# EAGLE design roco1044 (EAGLE 9.5.2)
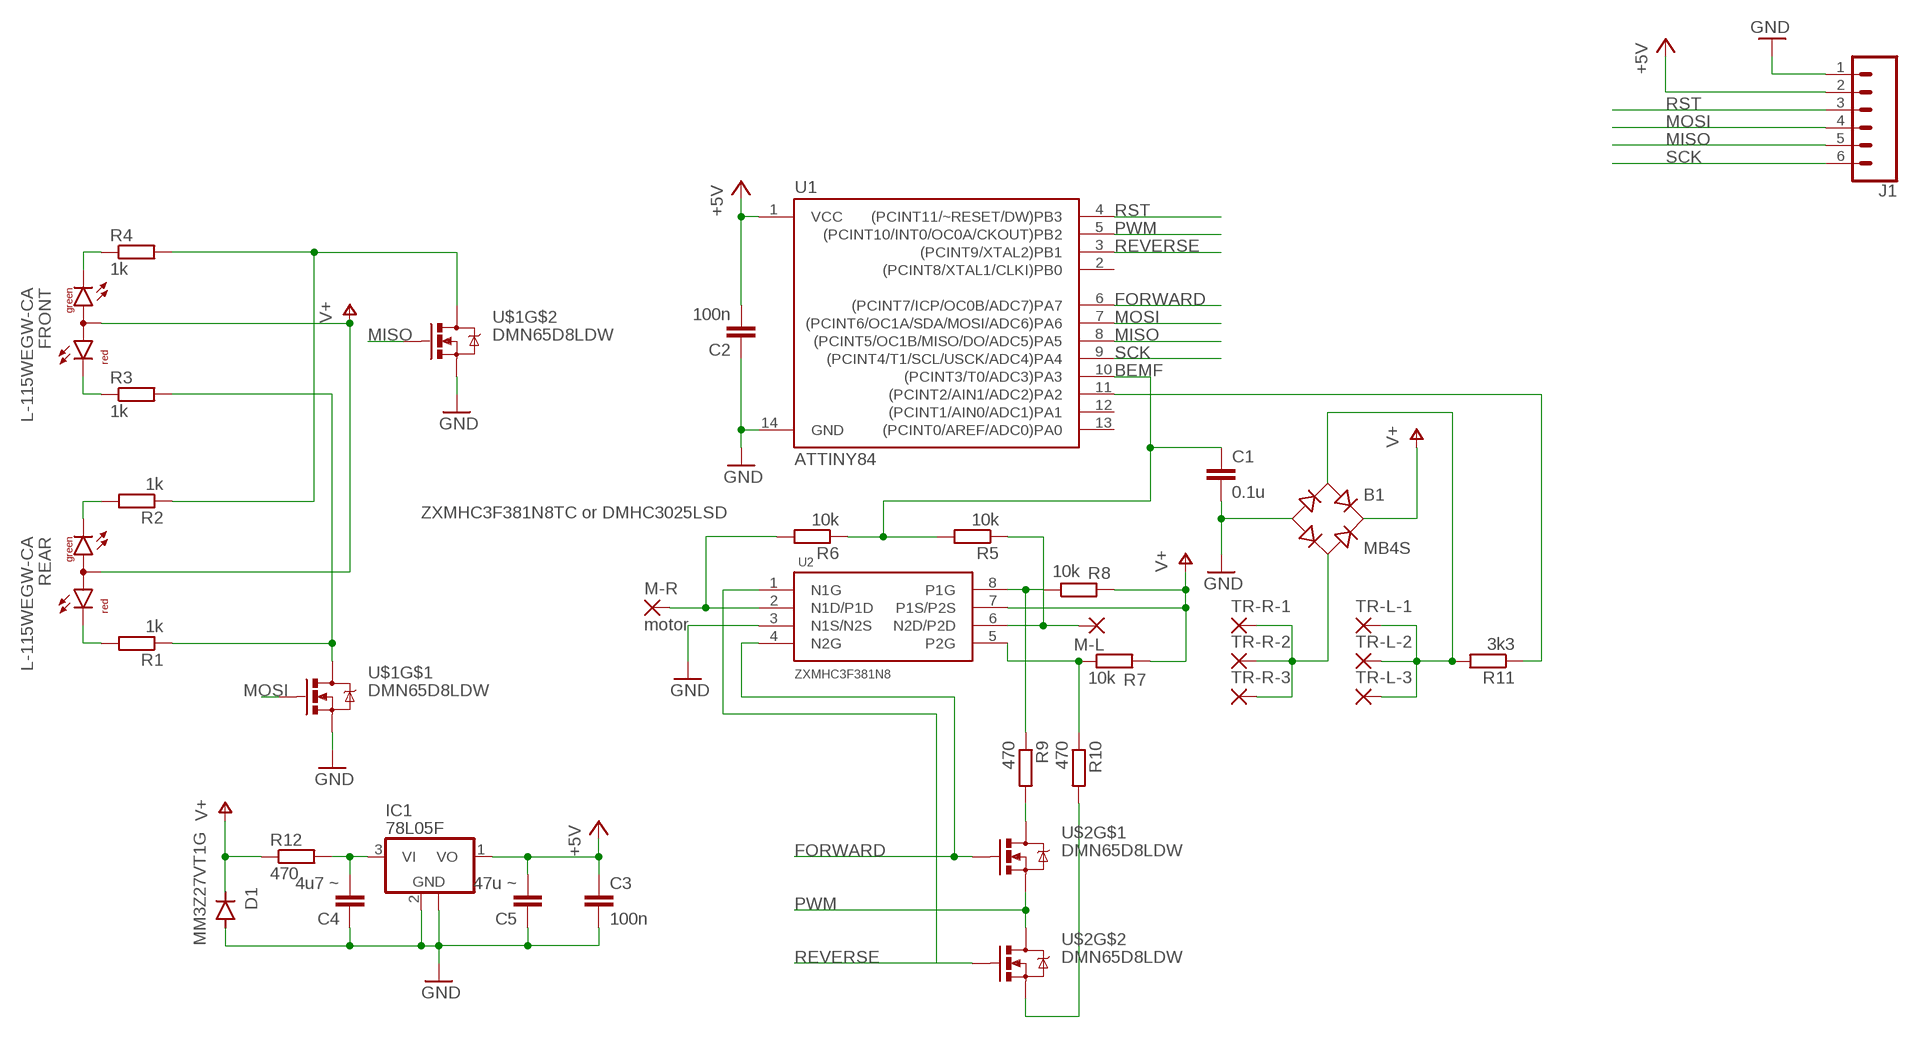
[diagram p0: schematic, sheet 1]

## Parts
B1  MB4S  [SOIC-4]
C1  0.1u  C-EUC0805  [C0805]
C2  100n  C-EUC1210  [C1210]
C3  100n  C-EUC1210  [C1210]
C4  4u7 ~  C-EUC3216  [C3216]
C5  47u ~  C-EUC3216  [C3216]
D1  MM3Z27VT1G  DIODE-SOD323-R  [SOD323-R]
FRONT  L-115WEGW-CA  [DUOLED-A-3MM]
IC1  78L05F  [SOT89]
J1  CONN_061.27MM  [1X06_1.27MM]
M-L  SMD5  [SMD2,54-5,08]
M-R  motor  SMD5  [SMD2,54-5,08]
R1  1k  R-EU_R0805  [R0805]
R2  1k  R-EU_R0805  [R0805]
R3  1k  R-EU_R0805  [R0805]
R4  1k  R-EU_R0805  [R0805]
R5  10k  R-EU_R0805  [R0805]
R6  10k  R-EU_R0805  [R0805]
R7  10k  R-EU_R0805  [R0805]
R8  10k  R-EU_R0805  [R0805]
R9  470  R-EU_R0805  [R0805]
R10  470  R-EU_R0805  [R0805]
R11  3k3  R-EU_R0805  [R0805]
R12  470  R-EU_R0805  [R0805]
REAR  L-115WEGW-CA  [DUOLED-A-3MM]
TR-L-1  SMD5  [SMD2,54-5,08]
TR-L-2  SMD5  [SMD2,54-5,08]
TR-L-3  SMD5  [SMD2,54-5,08]
TR-R-1  SMD5  [SMD2,54-5,08]
TR-R-2  SMD5  [SMD2,54-5,08]
TR-R-3  SMD5  [SMD2,54-5,08]
U1  ATTINY84  [SO14]
U2  ZXMHC3F381N8  [SOIC8]
U$1  DMN65D8LDW  [SOT363]
U$2  DMN65D8LDW  [SOT363]

## Nets
+5V: C2.2 C3.1 C5.2 IC1.1(VO) J1.2 U1.1(VCC)
BEMF: C1.1 R5.2 R6.1 U1.10((PCINT3/T0/ADC3)PA3)
FORWARD: U1.6((PCINT7/ICP/OC0B/ADC7)PA7) U2.4(N2G) U$2.P$2(G)
GND: B1.- C1.2 C2.1 C3.2 C4.1 C5.1 D1.A IC1.2(GND) IC1.2@1(GND) J1.1 U1.14(GND) U2.3(N1S/N2S) U$1.P$3(S) U$1.P$6(S)
MISO: J1.5 U1.8((PCINT5/OC1B/MISO/DO/ADC5)PA5) U$1.P$5(G)
MOSI: J1.4 U1.7((PCINT6/OC1A/SDA/MOSI/ADC6)PA6) U$1.P$2(G)
N$2: B1.~1(AC1) R11.2 TR-L-1.1(P) TR-L-2.1(P) TR-L-3.1(P)
N$3: B1.~2(AC2) TR-R-1.1(P) TR-R-2.1(P) TR-R-3.1(P)
N$4: M-R.1(P) R6.2 U2.2(N1D/P1D)
N$5: R2.1 R4.2 U$1.P$1(D)
N$6: R1.2 REAR.3(CR)
N$7: R2.2 REAR.1(CG)
N$8: R1.1 R3.2 U$1.P$4(D)
N$9: FRONT.3(CR) R3.1
N$10: FRONT.1(CG) R4.1
N$11: M-L.1(P) R5.1 U2.6(N2D/P2D)
N$12: R11.1 U1.11((PCINT2/AIN1/ADC2)PA2)
N$14: R7.1 R10.1 U2.5(P2G)
N$15: R8.1 R9.1 U2.8(P1G)
N$17: C4.2 IC1.3(VI) R12.2
N$20: R9.2 U$2.P$4(D)
N$22: R10.2 U$2.P$6(S)
PWM: U1.5((PCINT10/INT0/OC0A/CKOUT)PB2) U$2.P$1(D) U$2.P$3(S)
REVERSE: U1.3((PCINT9/XTAL2)PB1) U2.1(N1G) U$2.P$5(G)
RST: J1.3 U1.4((PCINT11/~RESET/DW)PB3)
SCK: J1.6 U1.9((PCINT4/T1/SCL/USCK/ADC4)PA4)
V+: B1.+ D1.C FRONT.2(A) R7.2 R8.2 R12.1 REAR.2(A) U2.7(P1S/P2S)
Unconnected: U1.2((PCINT8/XTAL1/CLKI)PB0) U1.12((PCINT1/AIN0/ADC1)PA1) U1.13((PCINT0/AREF/ADC0)PA0)

## Notes on the sheet
- ZXMHC3F381N8TC or DMHC3025LSD

## Library data of the parts
B1 = rectifier:MB*S: Bridge Rectifier Source: http://www.fairchildsemi.com/ds/MB/MB6S.pdf
C1 = resistor:C-EU: CAPACITOR, European symbol
C2-C5 = rcl:C-EU: CAPACITOR, European symbol; SPICEPREFIX: C
D1 = diode:DIODE-: DIODE
FRONT REAR = led:L-115WEGW-CA: T-1(3mm) BI-COLOR INDICATOR LAMP Source: Kingbright .. 2_colour_led_.pdf
IC1 = linear:78L*: POSITOIV-VOLTAGE REGULATORS Output up to 100 mA Source: Datasheet <http://focus.ti.com/lit/ds/symlink/ua78l05.pdf>
J1 = SparkFun-Connectors:CONN_06: Multi connection point. Often used as Generic Header-pin footprint for 0.1 inch spaced/style header connections On any of the 0.1 inch spaced packages, you can populate with these: Break Away Headers - Straight <https://www.sparkfun.com/products/116> (PRT-00116) Break Away Male Headers - Right Angle <https://www.sparkfun.com/products/553> (PRT-00553) Female Headers <https://www.sparkfun.com/products/115> (PRT-00115) Break Away Headers - Machine Pin <https://www.sparkfun.com/products/117> (PRT-00117) Break Away Female Headers - Swiss Machine Pin <https://www.sparkfun.com/products/743> (PRT-00743) Arduino Stackable Header - 6 Pin <https://www.sparkfun.com/products/9280> (PRT-09280) For SCREWTERMINALS and SPRING TERMINALS visit here: Screw Terimnals on SparkFun.com <https://www.sparkfun.com/search/results?term=Screw+Terminals> (5mm/3.5mm/2.54mm spacing) This device is also useful as a general connection point to wire up your design to another part of your project. Our various solder wires solder well into these plated through hole pads. Hook-Up Wire - Assortment (Stranded, 22 AWG) <https://www.sparkfun.com/products/11375> (PRT-11375) Hook-Up Wire - Assortment (Solid Core, 22 AWG) <https://www.sparkfun.com/products/11367> (PRT-11367) View the entire wire category on our website here <https://www.sparkfun.com/categories/141>
M-L M-R TR-L-1-TR-L-3 TR-R-1-TR-R-3 = wirepad:SMD5: SMD PAD
R1-R12 = rcl:R-EU_: RESISTOR, European symbol; SPICEPREFIX: R
U1 = SparkFun-IC-Microcontroller:ATTINY84: Atmel 14-pin 2/4/8kB flash uC Datasheet <https://cdn.sparkfun.com/datasheets/Widgets/doc8006.pdf> SparkFun Products Tiny AVR Programmer <https://www.sparkfun.com/products/11801> (PGM-11801) SparkFun Servo Trigger - Continuous Rotation <https://www.sparkfun.com/products/13872> (WIG-13872) SparkFun Servo Trigger <https://www.sparkfun.com/products/13118> (WIG-13118); PROD_ID: IC-11285
U2 = bt_motordriver:ZXMHC3F381N8: 30V SO8 Complementary enhancement mode MOSFET H-Bridge This new generation complementary MOSFET H-Bridge features low on-resistance achievable with low gate drive (Vgs=4.5V). Reference: <http://www.diodes.com/datasheets/ZXMHC3F381N8.pdf>http://www.diodes.com/datasheets/ZXMHC3F381N8.pdf
U$1 U$2 = Railstars:DMN65D8LDW

## Board
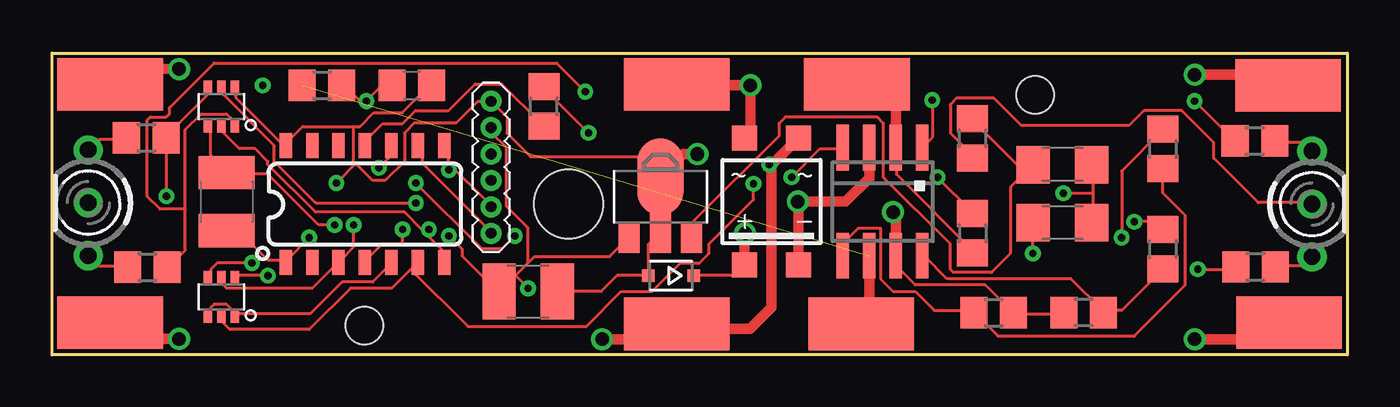
[diagram p1: board, top side]
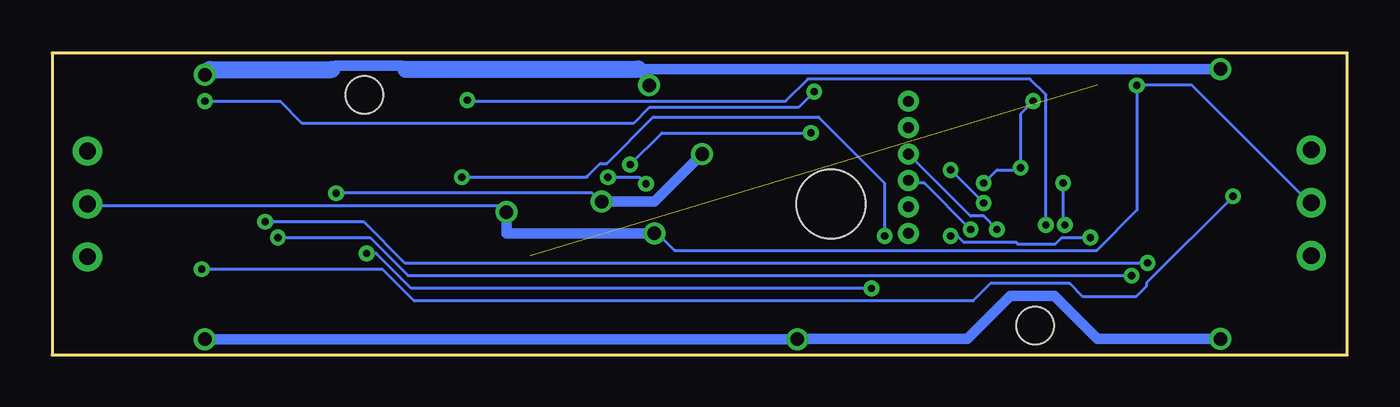
[diagram p2: board, bottom side, seen from below]

Size 62.2 x 14.5 mm. Coordinates in mm from the lower left corner, seen from the top.
Outline: 0,0 0,14.5 62.2,14.5 62.2,0 0,0
Copper layers (1*16): Top 0.035mm / dielectric 1.5mm / Bottom 0.035mm
Design rules "default *": minimum track width 6mil, minimum drill 0.35mm, track to track 6mil, track to pad 6mil, pad to pad 6mil, via to via 6mil, smd to smd 6mil, copper to edge 6mil, drill to drill 6mil, minimum pad ring 10mil, minimum via ring 8mil, stop-mask expansion 4mil, vias tented up to drill 0mil, thermal gap 10mil
Holes 1.8 mm at 15,1.4 47.2,12.5
Holes 3.3 mm at 24.8,7.25

### Footprints (pad centres in the part's own frame; a part is rotated, then mirrored left to right if it is on the bottom)
SOIC-4 = smd 1.2 x 1.2: + 1.3,3.05; - -1.3,3.05; ~1 -1.3,-3.05; ~2 1.3,-3.05
C0805 = smd 1.3 x 1.5: 1 -0.95,0; 2 0.95,0
C1210 = smd 1.6 x 2.7: 1 -1.4,0; 2 1.4,0
C3216 = smd 1.6 x 1.8: 1 -1.4,0; 2 1.4,0
SOD323-R = smd 0.6 x 0.6: A 1.1,0; C -1.1,0
DUOLED-A-3MM = drill 0.8 pad 1.4: 1 -2.54,0; 2 0,0; 3 2.54,0
SOT89 = smd 1 x 1.5: 1 -1.499,-1.981; 3 1.499,-1.981 | smd 1 x 2: 2 0,-1.727 | smd 2.2 x 3.7: 2@1 0,0.94
1X06_1.27MM = drill 0.508 pad 1: 1 0,0; 2 1.27,0; 3 2.54,0; 4 3.81,0; 5 5.08,0; 6 6.35,0
SMD2,54-5,08 = smd 2.54 x 5.08: 1 0,0
R0805 = smd 1.3 x 1.5: 1 -0.95,0; 2 0.95,0
SO14 = smd 0.6 x 1.2: 1 -3.175,-2.8; 2 -1.905,-2.8; 3 -0.635,-2.8; 4 0.635,-2.8; 5 1.905,-2.8; 6 3.175,-2.8; 7 4.445,-2.8; 8 4.445,2.8; 9 3.175,2.8; 10 1.905,2.8; 11 0.635,2.8; 12 -0.635,2.8; 13 -1.905,2.8; 14 -3.175,2.8
SOIC8 = smd 0.6 x 2.2: 1 -1.905,-2.6; 2 -0.635,-2.6; 3 0.635,-2.6; 4 1.905,-2.6; 5 1.905,2.6; 6 0.635,2.6; 7 -0.635,2.6; 8 -1.905,2.6
SOT363 = smd 0.42 x 0.6: P$1 -0.65,0.95; P$2 0,0.95; P$3 0.65,0.95; P$4 0.65,-0.95; P$5 0,-0.95; P$6 -0.65,-0.95

### Placement (x,y rotation side)
B1  34.54,7.37 180 top
C1  17.27,12.95 0 top
C2  8.38,7.37 270 top
C3  22.86,3.05 0 top
C4  48.51,9.14 180 top
C5  48.51,6.35 180 top
D1  29.72,3.81 180 top
FRONT  1.74,7.31 90 top
IC1  29.21,7.62 0 top
J1  21.08,12.19 270 top
M-L  38.85,1.5 90 top
M-R  38.65,13 90 top
R1  57.8,4.23 0 top
R2  57.75,10.28 0 top
R3  4.52,10.43 0 top
R4  4.58,4.22 0 top
R5  12.95,12.95 0 top
R6  44.2,5.84 270 top
R7  45.21,2.03 0 top
R8  49.53,2.03 180 top
R9  53.34,5.08 90 top
R10  53.34,9.91 90 top
R11  23.62,11.94 90 top
R12  44.2,10.41 90 top
REAR  60.5,7.25 270 top
TR-L-1  2.8,1.55 90 top
TR-L-2  59.4,1.55 90 top
TR-L-3  30,1.5 270 top
TR-R-1  2.8,13 90 top
TR-R-2  59.35,12.95 270 top
TR-R-3  30,13 90 top
U1  14.39,7.25 0 top
U2  39.88,7.37 180 top
U$1  8.13,11.94 180 top
U$2  8.13,2.79 180 top

### Tracks (layer width: path | path; a pad name or v marks a point on that pad's centre or on a via)
+5V  (via drill 0.35)
  Top 0.152: C2.2 8.38,5.94 8.99,5.94 10.36,4.57 11.12,4.57 U1.1 11.28,4.57 v12.34,5.64 | 22.25,3.81 21.49,3.05 C3.1 | 22.25,3.81 22.87,4.43 | 22.87,4.43 23.16,4.72 26.77,4.72 27.58,5.54 27.58,5.64 IC1.1 | v47.09,4.88 47.09,6.25 C5.2 | 22.25,3.81 v22.86,3.2 | 22.25,3.81 C3.1 | 22.87,4.43 22.86,4.45 22.86,6.1 21.82,7.14 21.82,9.96 21.08,10.69 J1.2 | v19.05,5.71 19.68,5.08 19.68,4.76 21.27,3.17 C3.1
  Bottom 0.152: v47.09,4.88 46.63,4.88 44.96,3.2 v22.86,3.2 | v12.34,5.64 13.72,5.64 14.02,5.33 15.85,5.33 15.88,5.4 18.41,5.4 18.73,5.71 v19.05,5.71
BEMF  (via drill 0.35)
  Top 0.152: v15.7,8.99 16.15,9.45 16.15,9.91 U1.10 | R5.2 14.02,12.95 14.78,12.19 v15.09,12.19 15.85,12.95 C1.1 | v42.52,8.53 44.2,6.86 R6.1 | v17.46,8.26 20.64,5.08 21.59,5.08 v22.23,5.71
  Bottom 0.152: v15.09,12.19 15.7,11.58 v15.7,8.99 15.88,8.89 16.83,8.89 v17.46,8.26 | v42.52,8.53 36.51,8.53 36.51,8.57 35.88,9.21 35.56,9.21 33.34,11.43 25.4,11.43 22.23,8.26 v22.23,5.71
FORWARD  (via drill 0.35)
  Top 0.152: 17.22,4.12 17.53,4.42 U1.6 | 17.22,4.12 16.31,3.2 14.33,3.2 12.34,1.22 8.53,1.22 8.23,1.52 8.23,1.83 U$2.P$2 | v35.51,8.53 36.88,9.91 37.95,9.91 U2.4 | v33.68,8.23 33.68,7.47 31.55,5.33 31.55,4.88 31.09,4.42 30.18,4.42 28.8,3.05 27.33,3.05 25.65,1.37 19.96,1.37 17.22,4.12
  Bottom 0.152: v35.51,8.53 33.98,8.53 v33.68,8.23
GND  (via drill 0.35, 0.65)
  Top 0.152: 11.12,10.06 8.84,12.34 8.84,12.8 U$1.P$6 | 14.48,10.97 12.04,10.97 11.12,10.06 | 14.48,10.97 14.78,10.97 15.44,11.63 16.82,11.63 18.14,12.95 C1.2 | 11.12,10.06 U1.14 | U$1.P$3 7.62,10.97 7.62,9.6 8.38,8.84 C2.1 8.38,8.69 10.36,8.69 12.8,6.25 v13.56,6.25 | 49.99,7.77 49.99,9.14 C4.1 | 49.99,7.77 49.99,6.4 C5.1 | 29.26,5.94 29.26,8.38 IC1.2@1 28.89,8.89 28.89,9.21 28.57,9.53 22.97,9.53 21.84,10.65 21.84,11.43 J1.1 20.45,12.19 19.42,11.16 17.41,11.16 16.92,10.67 16.92,9.3 16,8.38 15.39,8.38 14.59,9.19 | 29.26,5.94 IC1.2 | C3.2 26.36,3.05 27.13,3.81 D1.A 28.65,3.81 28.65,5.33 29.26,5.94 | v48.56,7.77 49.99,7.77 | 14.48,10.97 14.48,9.3 14.59,9.19 | 14.59,9.19 v13.65,8.26
  Top 0.508: B1.- 35.84,7.37 v35.81,7.37 38.1,7.37 39.24,8.51 U2.3 | v30.99,9.65 30.3,9.65 IC1.2@1
  Bottom 0.152: v48.56,7.77 36.27,7.77 35.97,7.47 v35.81,7.37 | v13.65,8.26 13.65,6.35 v13.56,6.25
  Bottom 0.508: v35.81,7.37 33.27,7.37 v30.99,9.65
MISO  (via drill 0.35)
  Top 0.152: U$1.P$5 8.23,12.8 8.23,12.5 10.67,10.06 10.67,9.3 12.68,7.28 12.7,7.3 v17.46,7.3 | 19.05,9.21 19.05,9.84 U1.8 | 19.05,9.21 20.95,7.3 J1.5 | v19.05,8.89 19.05,9.21
  Bottom 0.152: v17.46,7.3 v19.05,8.89
MOSI  (via drill 0.35)
  Top 0.152: 18.75,5.03 17.76,6.01 | 17.76,6.01 16.92,6.86 12.65,6.86 10.36,9.14 10.36,9.3 9.75,9.91 8.99,9.91 8.23,10.67 8.23,10.97 U$1.P$2 | 18.75,5.03 18.75,4.57 U1.7 18.75,5.03 | v18.1,6.03 17.78,6.03 17.76,6.01
  Bottom 0.152: v18.1,6.03 20.32,8.26 20.95,8.26 J1.4
N$2  (via drill 0.35, 0.65)
  Top 0.152: v25.76,10.67 23.62,12.8 R11.2 | v34.44,9.14 34.54,9.12
  Top 0.508: TR-L-1.1 3.28,1.07 3.28,1.04 3.56,0.76 v6.1,0.76 | 29.74,1.24 29.26,0.76 v26.42,0.76 | 29.74,1.24 TR-L-3.1 | v54.86,0.76 58.67,0.76 58.96,1.04 58.96,1.11 TR-L-2.1 | B1.~1 34.54,9.12 34.54,2.29 33.5,1.24 29.74,1.24
  Bottom 0.152: v25.76,10.67 32.92,10.67 v34.44,9.14
  Bottom 0.508: v6.1,0.76 12.01,0.76 14.08,2.83 16.18,2.83 18.25,0.76 v26.42,0.76 | v26.42,0.76 | v54.86,0.76 v26.42,0.76
N$3  (via drill 0.65)
  Top 0.508: TR-R-2.1 58.84,13.46 57.41,13.46 57.4,13.46 v54.86,13.46 | B1.~2 33.53,10.7 v33.53,12.95 30.05,12.95 TR-R-3.1 | TR-R-1.1 2.8,13.26 3.27,13.72 5.85,13.76 5.87,13.74 v6.1,13.74
  Bottom 0.508: 48.77,13.72 48.59,13.89 45.41,13.91 45.22,13.72 | v33.53,12.95 33.53,13.21 34.06,13.74 v6.1,13.74
  Bottom 0.813: v54.86,13.46 54.61,13.72 48.77,13.72 | 45.22,13.72 34.06,13.74
N$4
  Top 0.152: R6.2 44.2,5.03 40.54,8.69 40.54,9.75 U2.2
  Top 0.508: U2.2 40.51,12.83 40.64,12.95 40.59,13 M-R.1
N$5  (via drill 0.35)
  Top 0.152: 6.4,7.01 6.4,5.03 5.64,4.27 R4.2 | 6.4,7.01 6.4,10.82 7.16,11.58 8.38,11.58 8.69,11.28 8.69,11.12 U$1.P$1 | v54.86,12.19 56.69,10.36 R2.1 | v25.6,12.65 24.23,14.02 7.77,14.02 5.64,11.89 5.64,11.58 5.49,11.43 4.72,11.43 4.57,11.28 4.57,7.62 5.18,7.01 6.4,7.01
  Bottom 0.152: v54.86,12.19 51.26,12.19 50.19,11.12 34.29,11.12 33.53,11.89 26.36,11.89 v25.6,12.65
N$6
  Top 0.152: R1.2 58.83,4.27 60.05,4.27 60.35,4.57 REAR.3
N$7
  Top 0.152: R2.2 58.83,10.21 60.05,10.21 60.35,9.91 REAR.1
N$8  (via drill 0.35)
  Top 0.152: U$1.P$4 7.47,12.8 7.47,12.5 5.49,10.52 R3.2 5.49,10.36 v5.49,7.62 | v55.02,4.12 56.69,4.12 R1.1
  Bottom 0.152: v55.02,4.12 46.33,4.12 44.81,2.59 17.98,2.59 17.14,3.43 13.34,3.43 12.7,2.79 10.16,2.79 9.65,3.3 9.65,3.45 v5.49,7.62
N$9
  Top 0.152: R3.1 3.5,10.36 2.29,10.36 1.83,9.91 FRONT.3
N$10
  Top 0.152: R4.1 3.5,4.27 2.29,4.27 1.83,4.72 FRONT.1
N$11  (1 unrouted)
  Top 0.508: U2.6 39.24,1.89 M-L.1
N$12
  Top 0.152: R11.1 23.5,11.11 21.59,13.02 20.32,13.02 19.05,11.75 17.46,11.75 16.83,11.11 15.88,11.11 14.92,10.16 U1.11
N$14
  Top 0.152: U2.5 38.1,4.88 38.1,5.49 38.71,6.1 39.78,6.1 39.78,3.66 40.39,3.05 41.45,3.05 42.37,2.13 44.2,2.13 R7.1 44.35,1.98 45.41,0.91 51.97,0.91 54.41,3.35 54.41,6.71 53.34,7.77 R10.1
N$15
  Top 0.152: R9.1 53.34,4.12 51.36,2.13 50.6,2.13 R8.1 50.44,2.13 48.92,3.66 42.98,3.66 41.91,4.72 U2.8
N$17
  Top 0.152: 46.79,8.84 47.09,9.14 C4.2 46.79,8.84 | 46.79,8.84 46.02,8.08 46.02,4.88 45.11,3.96 43.28,3.96 43.13,4.12 43.13,5.33 39.93,8.53 39.93,11.12 39.62,11.43 35.2,11.43 34.9,11.12 34.9,10.52 30.79,6.4 30.79,5.79 IC1.3 | 46.79,8.84 46.63,8.84 44.2,11.28 R12.2
N$20  (via drill 0.35)
  Top 0.152: v9.6,4.42 7.92,4.42 7.62,4.12 7.62,3.81 U$2.P$4 | v51.97,6.4 53.03,6.4 53.34,6.1 R9.2
  Bottom 0.152: v9.6,4.42 45.26,4.42 47.24,6.4 v51.97,6.4
N$22  (via drill 0.35)
  Top 0.152: v10.36,3.81 8.84,3.81 U$2.P$6 | v51.36,5.64 51.36,8.84 53.34,10.82 R10.2
  Bottom 0.152: v10.36,3.81 45.11,3.81 46.94,5.64 v51.36,5.64
PWM
  Top 0.152: 8.84,1.98 8.38,2.44 7.77,2.44 7.62,2.29 7.62,1.98 U$2.P$3 | 8.84,1.98 12.39,1.98 13.92,3.5 15.39,3.5 16.31,4.42 U1.5 | 8.84,1.98 U$2.P$1
REVERSE  (via drill 0.35)
  Top 0.152: U$2.P$5 8.23,3.66 8.23,3.35 8.38,3.2 12.5,3.2 13.72,4.42 U1.3 13.87,4.57 14.48,5.18 v14.48,6.25 | v42.27,12.24 42.27,10.45 U2.1
  Bottom 0.152: v42.27,12.24 42.22,12.19 26.98,12.19 25.91,13.26 15.24,13.26 14.48,12.5 v14.48,6.25
RST  (via drill 0.35)
  Top 0.152: U1.4 15.09,4.57 15.85,5.33 16.83,5.33 v16.83,6.03
  Bottom 0.152: J1.3 18.1,6.67 17.46,6.67 v16.83,6.03
SCK
  Top 0.152: U1.9 17.78,9.84 17.78,9.21 20.95,6.03 J1.6
V+  (via drill 0.35, 0.65)
  Top 0.152: R12.1 44.2,9.6 43.13,10.67 43.13,12.04 43.43,12.34 45.21,12.34 46.53,11.02 51.71,11.02 52.43,11.73 54.25,11.73 55.78,10.21 55.78,9.45 57.91,7.32 60.35,7.32 REAR.2 | D1.C 32.61,3.81 33.07,4.27 B1.+ | U2.7 40.54,4.57 40.54,4.27 41.45,3.35 44.81,3.35 46.02,2.13 R7.2 46.18,1.98 48.46,1.98 R8.2
  Top 0.508: B1.+ 33.24,5.84 v33.27,5.84 | v40.39,6.86 40.51,6.73 U2.7
  Bottom 0.152: FRONT.2 1.83,7.32 7.47,12.95 v10.11,12.95 10.11,6.96 12.04,5.03 32.31,5.03 33.07,5.79 v33.27,5.84 | REAR.2 60.35,7.16 40.69,7.16 v40.39,6.86
  Bottom 0.508: v33.27,5.84 40.39,5.84 v40.39,6.86